# Altium schematic sheet USB-Ethernet.SchDoc
size A3; Organization0: INDÚSTRIA DE MATERIAL BÉLICO DO BRASIL; Organization2: FÁBRICA DE MATERIAL DE; Organization3: COMUNICAÇÕES E ELETRÔNICA; Organization1: VINCULADA AO EXÉRCITO BRASILEIRO; USADOEQP: USADOEQP; Esquematico: Esquemático; CODIGO: Código; ESTOQUE: Estoque
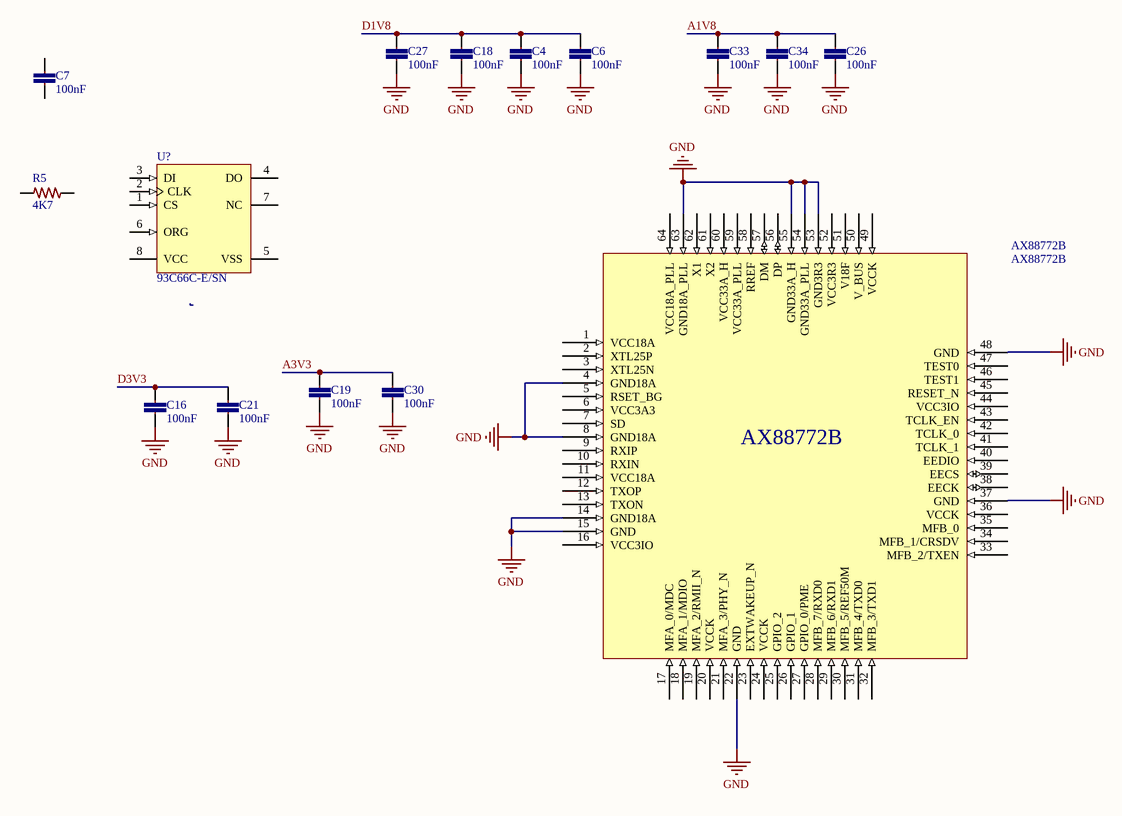
[diagram p0: USB-Ethernet.SchDoc]

## Parts
AX88772B  AX88772B  [AX88772B]
C4  100nF  [0402-CAP]
C6  100nF  [0402-CAP]
C7  100nF  [0402-CAP]
C16  100nF  [0402-CAP]
C18  100nF  [0402-CAP]
C19  100nF  [0402-CAP]
C21  100nF  [0402-CAP]
C26  100nF  [0402-CAP]
C27  100nF  [0402-CAP]
C30  100nF  [0402-CAP]
C33  100nF  [0402-CAP]
C34  100nF  [0402-CAP]
R5  4K7  [0402-RES]
U?  93C66C-E/SN  [SOIC-SN8_L]

## Nets
GND: AX88772B.4(GND18A) AX88772B.8(GND18A) AX88772B.14(GND18A) AX88772B.15(GND) AX88772B.22(GND) AX88772B.37(GND) AX88772B.48(GND) AX88772B.53(GND3R3) AX88772B.54(GND33A_PLL) AX88772B.55(GND33A_H) AX88772B.63(GND18A_PLL) C4.2 C6.2 C16.2 C18.2 C19.2 C21.2 C26.2 C27.2 C30.2 C33.2 C34.2
A1V8: C26.1 C33.1 C34.1
A3V3: C19.1 C30.1
D1V8: C4.1 C6.1 C18.1 C27.1
D3V3: C16.1 C21.1

Not connected (* = marked no-connect by the designer): AX88772B 1(VCC18A) 2(XTL25P) 3(XTL25N) 5(RSET_BG) 6(VCC3A3) 7(SD) 9(RXIP) 10(RXIN) 11(VCC18A) 12(TXOP) 13(TXON) 16(VCC3IO) 17(MFA_0/MDC) 18(MFA_1/MDIO) 19(MFA_2/RMII_N) 20(VCCK) 21(MFA_3/PHY_N) 23(EXTWAKEUP_N) 24(VCCK) 25(GPIO_2) 26(GPIO_1) 27(GPIO_0/PME) 28(MFB_7/RXD0) 29(MFB_6/RXD1) 30(MFB_5/REF50M) 31(MFB_4/TXD0) 32(MFB_3/TXD1) 33(MFB_2/TXEN) 34(MFB_1/CRSDV) 35(MFB_0) 36(VCCK) 38(EECK) 39(EECS) 40(EEDIO) 41(TCLK_1) 42(TCLK_0) 43(TCLK_EN) 44(VCC3IO) 45(RESET_N) 46(TEST1) 47(TEST0) 49(VCCK) 50(V_BUS) 51(V18F) 52(VCC3R3) 56(DP) 57(DM) 58(RREF) 59(VCC33A_PLL) 60(VCC33A_H) 61(X2) 62(X1) 64(VCC18A_PLL); C7 1 2; R5 1 2; U? 1(CS) 2(CLK) 3(DI) 4(DO) 5(VSS) 6(ORG) 7(NC) 8(VCC)

## Notes on the sheet
- USADO EQUIP.:
- ENG:
- REV:
- TÍTULO:
- DATA:
- HORA:
- APROV._______
- CÓDIGO:
- ESTOQUE:
- FOLHA:
- /
- FORMATO:
- A3

## Library data of the parts
C4 C6 C7 C16 C18 C19 C21 C26 C27 C30 C33 C34 = CC0402-100nF-50v-A.3: CAP CER 0.1UF 50V 10% X7R 0402; Part No: C1005X7R1H104K050BB; Cod EMS: 05.281.019.021; Value: 100n
R5 = R0402-4K7-2: RES 4.7K OHM 1/10W 1% 0402 SMD; Part No: ERJ-2RKF4701X; Cod EMS: 05.280.029.526
U? = CMP-0162-00109-1: 4K, 512x8 or 256x16-bit, 5.0V Microwire Serial EEPROM, 8-Pin SOIC 150mil, Extended Temperature; PackageVersion: revBB, Aug-2009; PackageDescription: 8-Lead Plastic Small Outline (SN) - Narrow, 3.90mm Body [SOIC]; PackageReference: SOIC-SN8; DatasheetVersion: revD, May-2008; Code_JEDEC: MS-012; Code_IPC: SOIC127P600-8